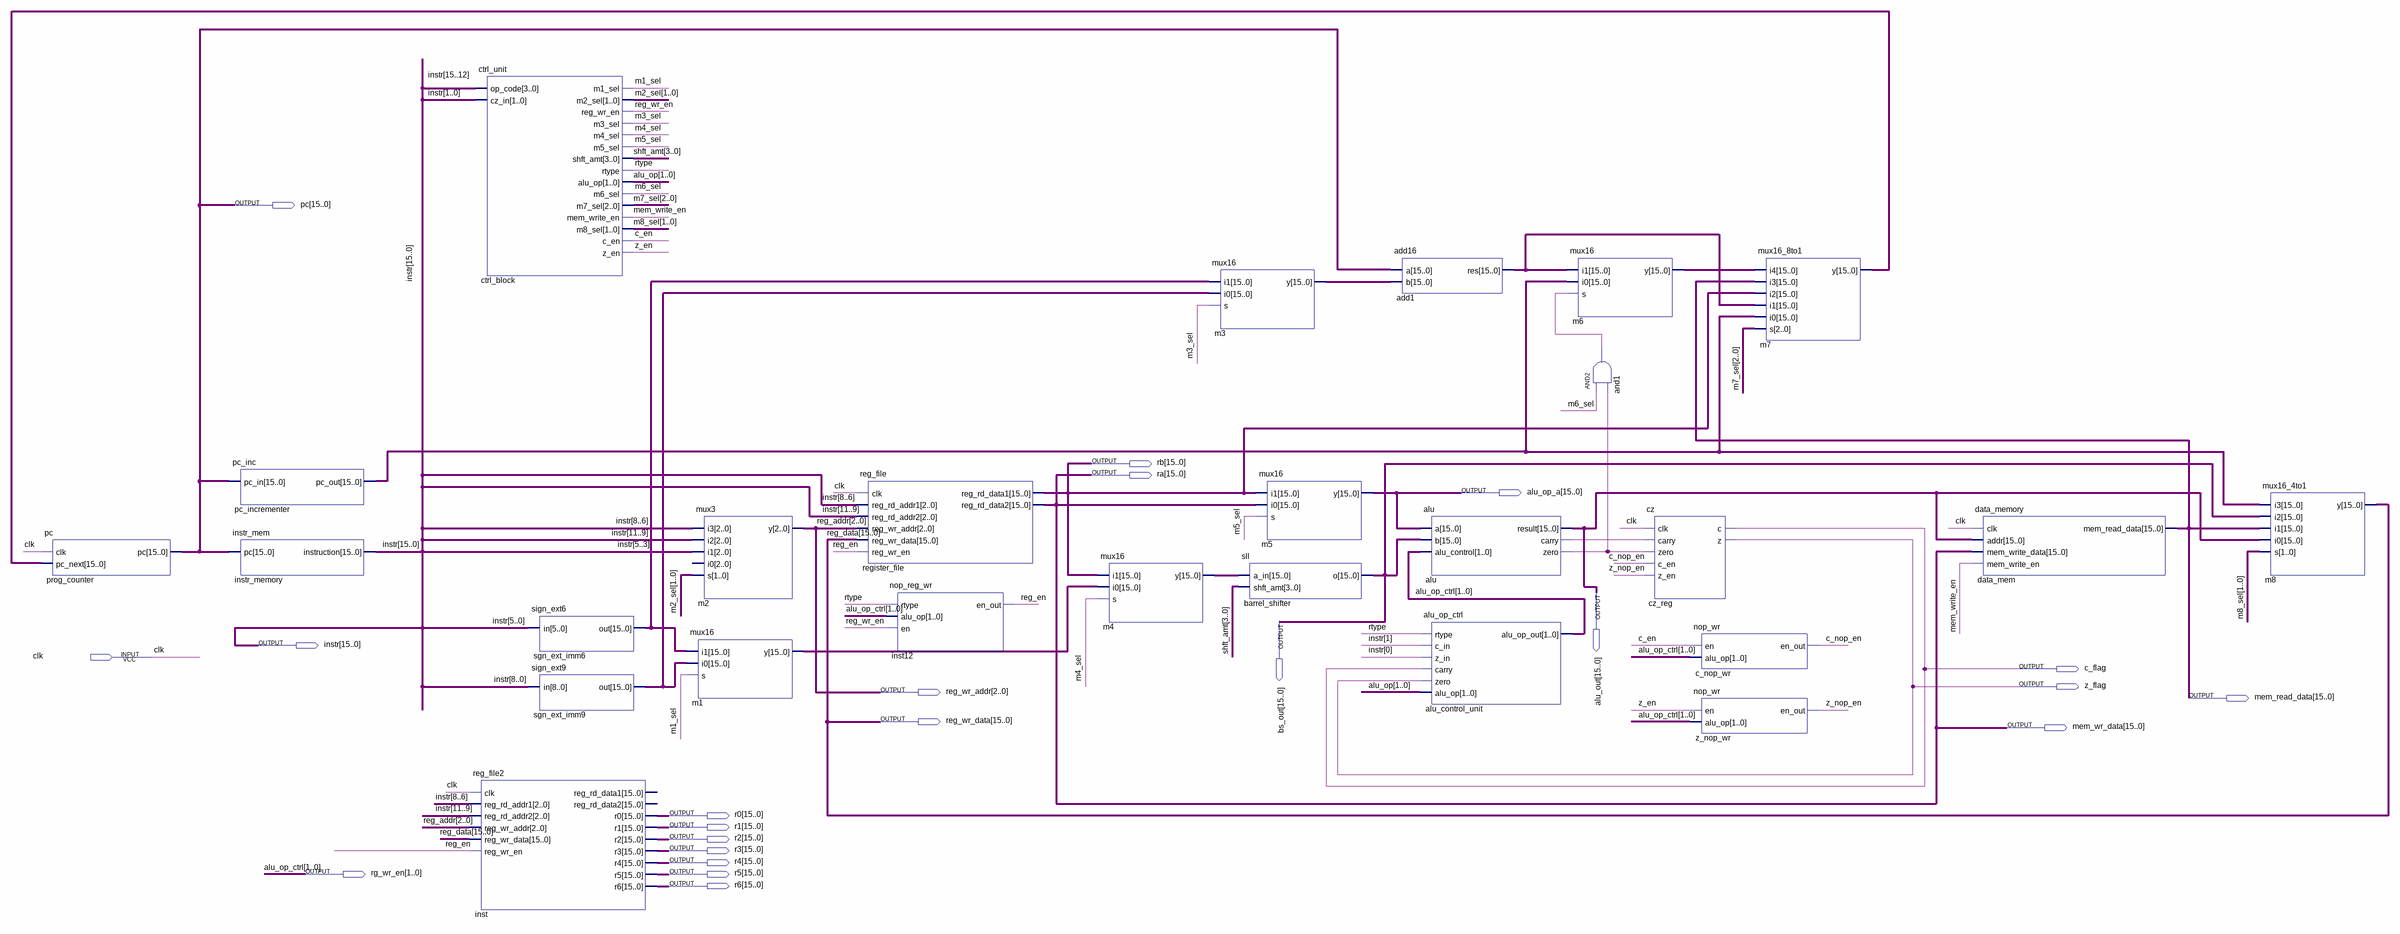
[diagram p0: schematic sheet]
// Quartus schematic pd_project1.bdf as structural Verilog: 26 symbols, 22 pins
module pd_project1 (
  input  clk,
  output [15:0] pc,
  output [15:0] rb,
  output [15:0] ra,
  output [15:0] alu_op_a,
  output [15:0] alu_out,
  output [15:0] bs_out,
  output [15:0] instr,
  output c_flag,
  output z_flag,
  output [2:0] reg_wr_addr,
  output [15:0] mem_read_data,
  output [15:0] reg_wr_data,
  output [15:0] mem_wr_data,
  output [15:0] r0,
  output [15:0] r1,
  output [15:0] r2,
  output [15:0] r3,
  output [15:0] r4,
  output [1:0] rg_wr_en,
  output [15:0] r5,
  output [15:0] r6
);

  wire alu_carry, alu_zero, and1_out, c_en, c_nop_en, m1_sel, m3_sel, m4_sel, m5_sel, m6_sel, mem_write_en,
       reg_en, reg_wr_en, rtype, z_en, z_nop_en;
  wire [1:0] alu_op, m2_sel, m8_sel;
  wire [2:0] m7_sel;
  wire [3:0] shft_amt;
  wire [15:0] add1_res, m1_y, m3_y, m4_y, m6_y, m7_y, pc_incrementer_pc_out, sgn_ext_imm6_out,
       sgn_ext_imm9_out;

  pc prog_counter (.clk(clk), .pc_next(m7_y), .pc(pc));
  pc_inc pc_incrementer (.pc_in(pc), .pc_out(pc_incrementer_pc_out));
  instr_mem instr_memory (.pc(pc), .instruction(instr));
  ctrl_unit ctrl_block (
    .op_code(instr[15:12]), .cz_in(instr[1:0]), .m1_sel(m1_sel), .m2_sel(m2_sel), .reg_wr_en(reg_wr_en),
    .m3_sel(m3_sel), .m4_sel(m4_sel), .m5_sel(m5_sel), .shft_amt(shft_amt), .rtype(rtype), .alu_op(alu_op),
    .m6_sel(m6_sel), .m7_sel(m7_sel), .mem_write_en(mem_write_en), .m8_sel(m8_sel), .c_en(c_en), .z_en(z_en));
  reg_file2 inst (
    .clk(clk), .reg_rd_addr1(instr[8:6]), .reg_rd_addr2(instr[11:9]), .reg_wr_addr(reg_wr_addr),
    .reg_wr_data(reg_wr_data), .reg_wr_en(reg_en), .r0(r0), .r1(r1), .r2(r2), .r3(r3), .r4(r4), .r5(r5),
    .r6(r6));  // open: reg_rd_data1, reg_rd_data2
  sign_ext6 sgn_ext_imm6 (.in(instr[5:0]), .out(sgn_ext_imm6_out));
  sign_ext9 sgn_ext_imm9 (.in(instr[8:0]), .out(sgn_ext_imm9_out));
  mux3 m2 (.i3(instr[8:6]), .i2(instr[11:9]), .i1(instr[5:3]), .s(m2_sel), .y(reg_wr_addr));  // open: i0
  mux16 m1 (.i1(sgn_ext_imm6_out), .i0(sgn_ext_imm9_out), .s(m1_sel), .y(m1_y));
  reg_file register_file (
    .clk(clk), .reg_rd_addr1(instr[8:6]), .reg_rd_addr2(instr[11:9]), .reg_wr_addr(reg_wr_addr),
    .reg_wr_data(reg_wr_data), .reg_wr_en(reg_en), .reg_rd_data1(rb), .reg_rd_data2(mem_wr_data));
  nop_reg_wr inst12 (.rtype(rtype), .alu_op(rg_wr_en), .en(reg_wr_en), .en_out(reg_en));
  mux16 m4 (.i1(rb), .i0(m1_y), .s(m4_sel), .y(m4_y));
  mux16 m3 (.i1(sgn_ext_imm6_out), .i0(sgn_ext_imm9_out), .s(m3_sel), .y(m3_y));
  mux16 m5 (.i1(rb), .i0(mem_wr_data), .s(m5_sel), .y(alu_op_a));
  sll barrel_shifter (.a_in(m4_y), .shft_amt(shft_amt), .o(bs_out));
  add16 add1 (.a(pc), .b(m3_y), .res(add1_res));
  alu alu (.a(alu_op_a), .b(bs_out), .alu_control(rg_wr_en), .result(alu_out), .carry(alu_carry), .zero(alu_zero));
  alu_op_ctrl alu_control_unit (
    .rtype(rtype), .c_in(instr[1]), .z_in(instr[0]), .carry(c_flag), .zero(z_flag), .alu_op(alu_op),
    .alu_op_out(rg_wr_en));
  mux16 m6 (.i1(add1_res), .i0(pc_incrementer_pc_out), .s(and1_out), .y(m6_y));
  and and1 (and1_out, m6_sel, alu_zero);
  cz cz_reg (.clk(clk), .carry(alu_carry), .zero(alu_zero), .c_en(c_nop_en), .z_en(z_nop_en), .c(c_flag), .z(z_flag));
  nop_wr c_nop_wr (.en(c_en), .alu_op(rg_wr_en), .en_out(c_nop_en));
  nop_wr z_nop_wr (.en(z_en), .alu_op(rg_wr_en), .en_out(z_nop_en));
  mux16_8to1 m7 (
    .i4(m6_y), .i3(mem_read_data), .i2(rb), .i1(add1_res), .i0(pc_incrementer_pc_out), .s(m7_sel), .y(m7_y));
  data_memory data_mem (
    .clk(clk), .addr(alu_out), .mem_write_data(mem_wr_data), .mem_write_en(mem_write_en),
    .mem_read_data(mem_read_data));
  mux16_4to1 m8 (
    .i3(pc_incrementer_pc_out), .i2(bs_out), .i1(mem_read_data), .i0(alu_out), .s(m8_sel), .y(reg_wr_data));

  assign ra = mem_wr_data;

  // Other names for the same wires on the sheet: alu_op_ctrl[1:0] = rg_wr_en; reg_addr[2:0] = reg_wr_addr;
  //   reg_data[15:0] = reg_wr_data
endmodule
